# Altium schematic sheet CPU.SchDoc
size A4; SheetNumber: 4; SheetTotal: 5
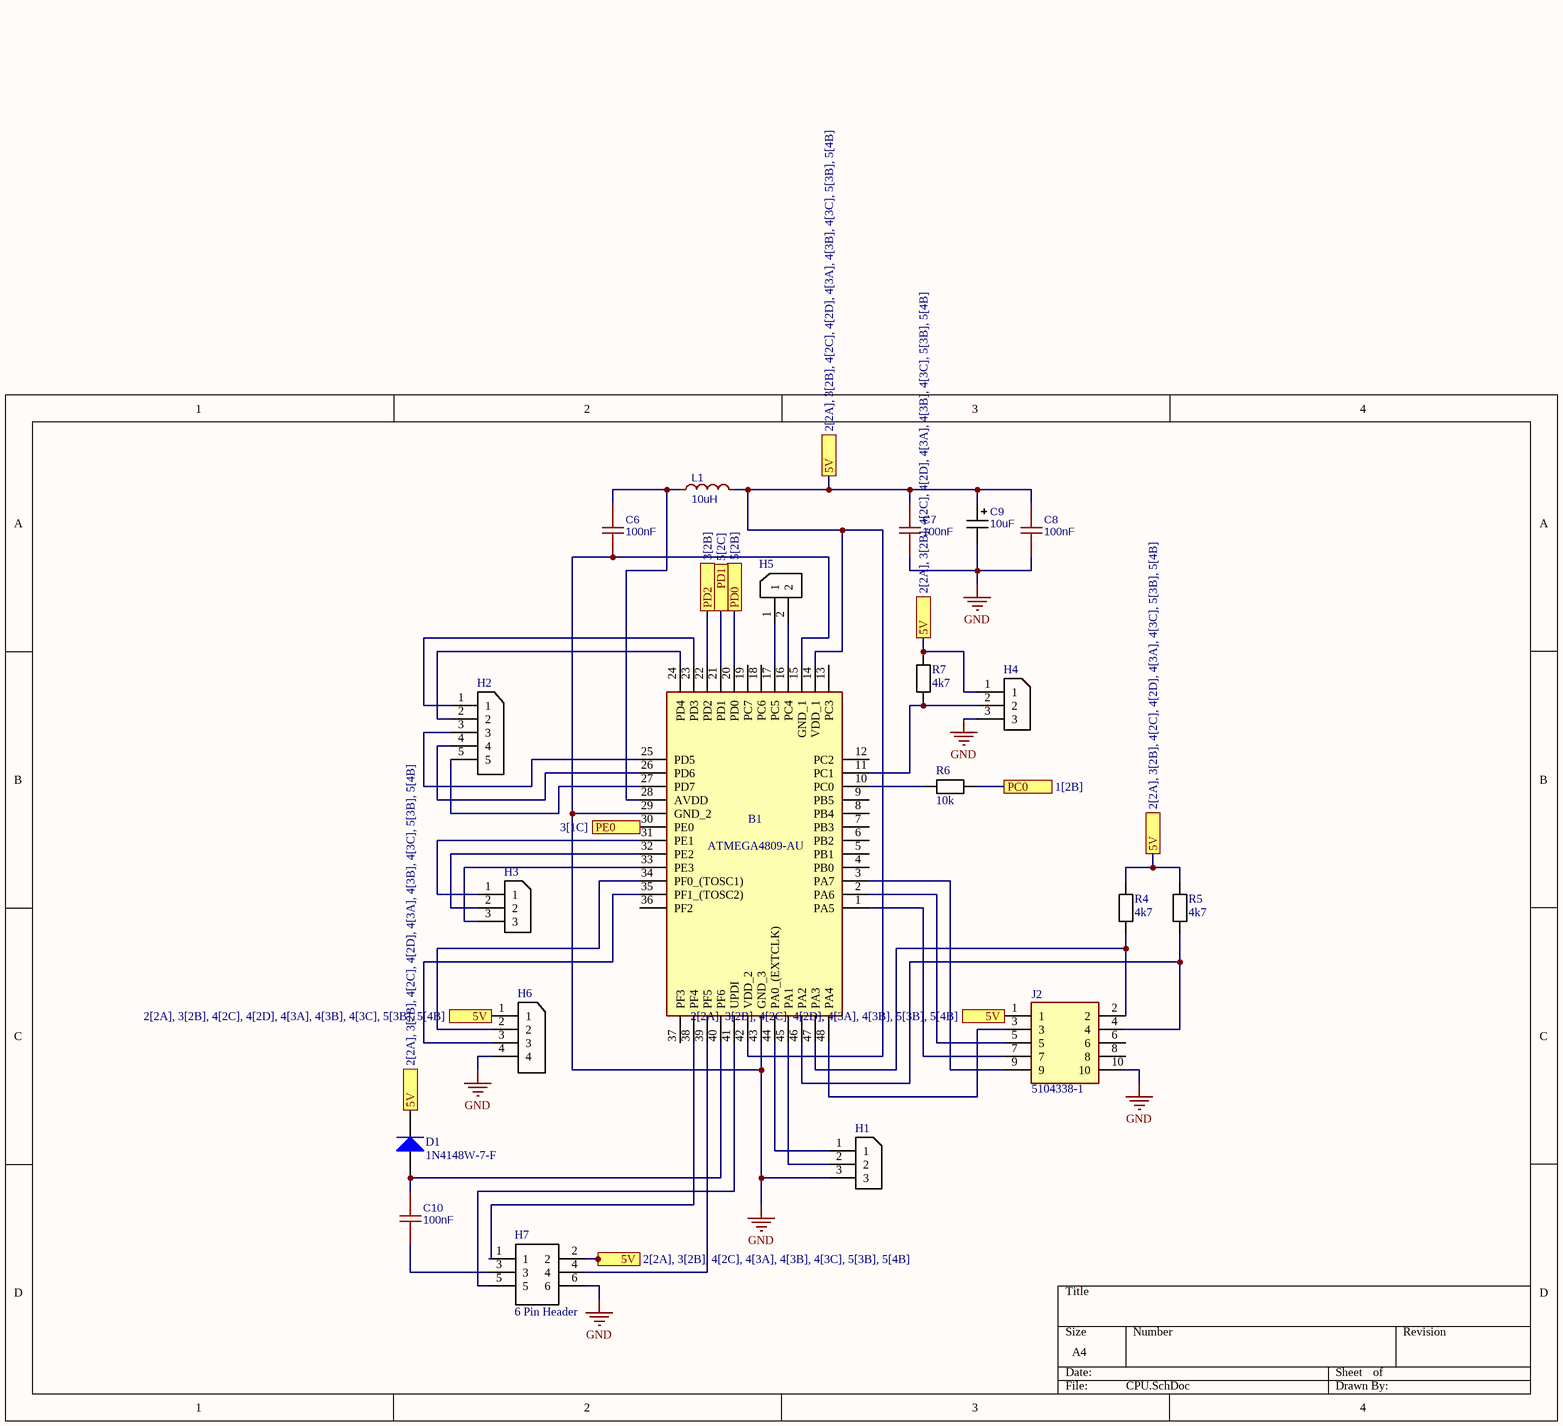
[diagram p0: CPU.SchDoc]

## Parts
B1  ATMEGA4809-AU  [ATMEGA4809-AU]
C6  100nF  [10nF]
C7  100nF  [R0805]
C8  100nF  [10nf]
C9  10uF  [10uf]
C10  100nF  [10nf]
D1  1N4148W-7-F  [1N4148W]
H1  3 Pin Header  [3 Pin Header]  (value not drawn)
H2  5 Pin Header  [5 Pin Header]  (value not drawn)
H3  3 Pin Header  [3 Pin Header]  (value not drawn)
H4  3 Pin Header  [3 Pin Header]  (value not drawn)
H5  Pin Header  [2 Pin Header]  (value not drawn)
H6  4 Pin Header  [4 Pin Header]  (value not drawn)
H7  6 Pin Header  [6 Pin Header]
J2  5104338-1  [10 Pin Boxheader]
L1  10uH  [10uH INDUCT SMD]
R4  4k7  [R0805]
R5  4k7  [R0805]
R6  10k  [R0805]
R7  4k7  [R0805]

## Ports
5V (see 2[2A], 3[2B], 4[2C], 4[2D], 4[3A], 4[3B], 4[3C], 5[3B], 5[4B]), 5V (see 2[2A], 3[2B], 4[2C], 4[2D], 4[3A], 4[3B], 5[3B], 5[4B]), 5V (see 2[2A], 3[2B], 4[2C], 4[2D], 4[3A], 4[3C], 5[3B], 5[4B]), 5V (see 2[2A], 3[2B], 4[2C], 4[3A], 4[3B], 4[3C], 5[3B], 5[4B]), PC0 (see 1[2B]), PD0 (see 5[2B]), PD1 (see 5[2C]), PD2 (see 3[2B]), PE0 (see 3[1C])

## Nets
GND: B1.15(GND_1) B1.29(GND_2) B1.43(GND_3) C6.1 C7.1 C8.1 C9.2 H1.3 H4.3 H6.4 H7.6 J2.10
5V: B1.14(VDD_1) B1.42(VDD_2) C7.2 C8.2 C9.1 D1.2(K) H4.1 H6.1 H7.2 J2.1 L1.2 R4.2 R5.2 R7.2 ; port 5V
PC0: R6.2 ; port PC0
PD0: B1.20(PD0) ; port PD0
PD1: B1.21(PD1) ; port PD1
PD2: B1.22(PD2) ; port PD2
PE0: B1.30(PE0) ; port PE0
NetB1_1: B1.1(PA5) J2.7
NetB1_2: B1.2(PA6) J2.5
NetB1_3: B1.3(PA7) J2.9
NetB1_10: B1.10(PC0) R6.1
NetB1_11: B1.11(PC1) H4.2 R7.1
NetB1_16: B1.16(PC4) H5.2
NetB1_17: B1.17(PC5) H5.1
NetB1_23: B1.23(PD3) H2.1
NetB1_24: B1.24(PD4) H2.2
NetB1_25: B1.25(PD5) H2.3
NetB1_26: B1.26(PD6) H2.4
NetB1_27: B1.27(PD7) H2.5
NetB1_28: B1.28(AVDD) C6.2 L1.1
NetB1_31: B1.31(PE1) H3.1
NetB1_32: B1.32(PE2) H3.2
NetB1_33: B1.33(PE3) H3.3
NetB1_34: B1.34(PF0_(TOSC1)) H6.2
NetB1_35: B1.35(PF1_(TOSC2)) H6.3
NetB1_38: B1.38(PF4) H7.1
NetB1_39: B1.39(PF5) H7.4
NetB1_40: B1.40(PF6) C10.2 D1.1(A)
NetB1_41: B1.41(UPDI) H7.5
NetB1_44: B1.44(PA0_(EXTCLK)) H1.1
NetB1_45: B1.45(PA1) H1.2
NetB1_46: B1.46(PA2) J2.4 R5.1
NetB1_47: B1.47(PA3) J2.2 R4.1
NetB1_48: B1.48(PA4) J2.3
NetC10_1: C10.1 H7.3

Not connected (* = marked no-connect by the designer): B1 4(PB0) 5(PB1) 6(PB2) 7(PB3) 8(PB4) 9(PB5) 12(PC2) 13(PC3) 18(PC6) 19(PC7) 36(PF2) 37(PF3); J2 6 8

## Library data of the parts
B1 = ATMEGA4809-AU: 8-bit Microcontrollers - MCU 20MHz, 48KB, TQFP; Manufacturer_Name: Microchip; Geometry.Height: 1.2mm; Mouser Part Number: 556-ATMEGA4809-AU; Mouser Price/Stock: https://www.mouser.co.uk/ProductDetail/Microchip-Technology-Atmel/ATMEGA4809-AU?qs=P1JMDcb91o4zLIorxO9tIg%3D%3D; Manufacturer_Part_Number: ATMEGA4809-AU; Datasheet Link: *
C6-C8 C10 = 10nF: BOM_Manufacturer: CCTC(三环); BOM_Manufacturer Part: TCC0805X7R103M500DT; nameAlias: Capacitance; Contributor: LCSC; BOM_Supplier: LCSC; BOM_Supplier Part: C376921; BOM_JLCPCB Part Class: Extended Part; spicePre: C; spiceSymbolName: TCC0805X7R103M500DT
C9 = 10uF: BOM_Manufacturer: ST(先科); BOM_Manufacturer Part: CS1E100M-CRC54; nameAlias: Capacitance; Contributor: LCSC; BOM_Supplier: LCSC; BOM_Supplier Part: C98750; BOM_JLCPCB Part Class: Extended Part; spicePre: C; spiceSymbolName: CS1E100M-CRC54
D1 = 1N4148W: Fast Switching Diode, 100 V, 0.15 A, -65 to 150 degC, 2-Pin?SOD123, RoHS, Tape and Reel; Recovery Time: 4ns; Brand: DiodesIncorporated; Unit Weight: 0.000353oz; Max Surge Current: 2A; Peak Reverse Voltage: 100V; Ir - Reverse Current: 1uA; Vf - Forward Voltage: 1.25V; Configuration: Single; If - Forward Current: 0.15A; Product Category: Diodes-GeneralPurpose,Power,Switching; Operating Temperature Range: -65Cto+150C; Packaging: Reel; Manufacturer URL: http://www.diodes.com/; Maximum Operating Temperature: +150C; Height: 1.25mm; Minimum Operating Temperature: -65C; Product: SwitchingDiodes; Package URL: http://www.diodes.com/datasheets/ds18004.pdf; Type: SwitchingDiode; Package Reference: SOD123-2; Width: 1.7mm; Datasheet URL: http://www.farnell.com/datasheets/1915529.pdf; Datasheet Version: Rev. 24-2, 10/2013; Series: 1N4148; Factory Pack Quantity: 3000; Length: 2.85mm; RoHS: True; Manufacturer: DiodesIncorporated; Mounting Style: SMD/SMT; Package / Case: SOD-123
H5 = 2 Pin Header: Connector Terminal Blocks Receptacle 2 Position 5.08mm Solder Straight Thru-Hole 13.5A/Contact; MP: 282837-2; MF: TE Connectivity; Check_prices: https://www.snapeda.com/parts/282837-2/TE+Connectivity+AMP+Connectors/view-part/?ref=eda; Value: *; Availability: In Stock; Price: None; Package: None; SnapEDA_Link: https://www.snapeda.com/parts/282837-2/TE+Connectivity+AMP+Connectors/view-part/?ref=snap; Purchase-URL: https://pricing.snapeda.com/search/part/282837-2/?ref=eda
J2 = 10 Pin Boxheader: Header vert 10 way 2.54mm AmpLatch; Manufacturer_Name: TE Connectivity; Geometry.Height: 9.855mm; Mouser Part Number: 571-5104338-1; Mouser Price/Stock: https://www.mouser.co.uk/ProductDetail/TE-Connectivity/5104338-1?qs=84A%2FDAdkstJBRnv2z9usOA%3D%3D; Manufacturer_Part_Number: 5104338-1; Datasheet Link: https://www.te.com/commerce/DocumentDelivery/DDEController?Action=showdoc&DocId=Customer+Drawing%7F5104338%7FE%7Fpdf%7FEnglish%7FENG_CD_5104338_E.pdf%7F5104338-1
L1 = 10uH: BOM_Manufacturer: KOHERelec(科或); BOM_Manufacturer Part: PMI201214S-100M; nameAlias: Inductance; Contributor: LCSC; BOM_Supplier: LCSC; BOM_Supplier Part: C2922559; BOM_JLCPCB Part Class: Extended Part; spicePre: L; spiceSymbolName: PMI201214S-100M
R4-R7 = Resistor: Manufacturer: Vishay Dale; Part Number: CRCW08050000Z0EA